# Altium schematic sheet fpga-bank1.SchDoc: FPGA - Bank 1
size Legal; CheckedBy: J. Brinton; CompanyName: Signal Laboratories, Inc.; DrawnBy: J. Brinton; Engineer: J. Brinton; Address1: 3479 Edison Way; Address2: Menlo Park CA 94025; Address3: +1 (877) 778-8435; Address4: siglabs.com; DocumentNumber: 28; Revision: 2b; SheetNumber: 29; SheetTotal: 58
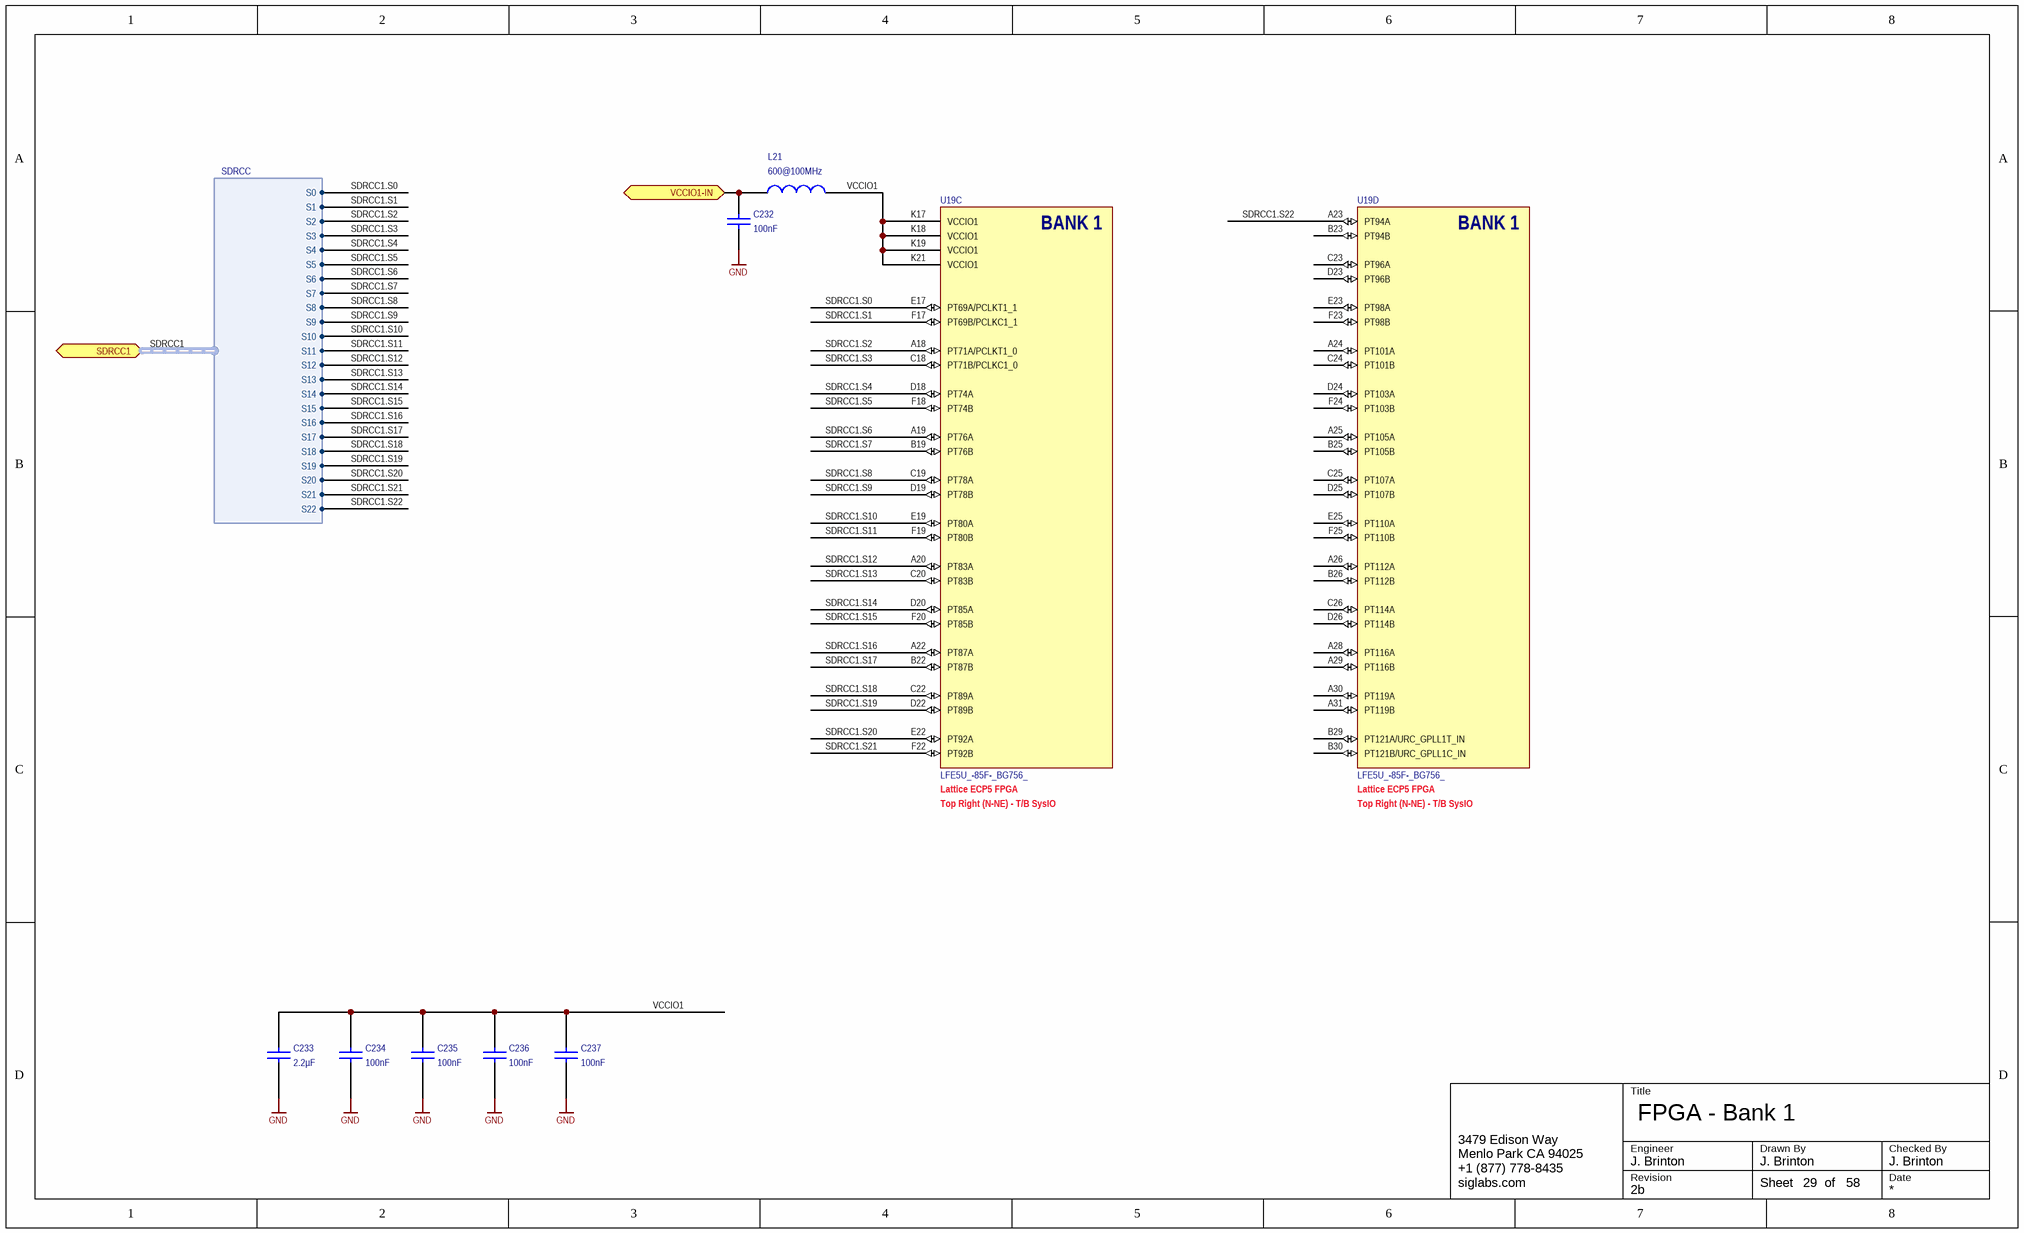
[diagram p0: fpga-bank1.SchDoc]

## Parts
C232  value 100nF  [CAPC1005X56N]  (hidden comment: GRM155R71C104KA88J)
C233  value 2.2µF  [CAPC1608X90N]  (hidden comment: GRM21BR71C225KA12L)
C234  value 100nF  [CAPC1005X56N]  (hidden comment: GRM155R71C104KA88J)
C235  value 100nF  [CAPC1005X56N]  (hidden comment: GRM155R71C104KA88J)
C236  value 100nF  [CAPC1005X56N]  (hidden comment: GRM155R71C104KA88J)
C237  value 100nF  [CAPC1005X56N]  (hidden comment: GRM155R71C104KA88J)
L21  value 600@100MHz  [0402]  (hidden comment: BLM15PX601SN1D)
U19  LFE5U_-85F-_BG756_  [caBGA756]  (parts C,D of 19)

## Ports
SDRCC1 (harness SDRCC), VCCIO1-IN

## Harnesses
SDRCC: S0, S1, S2, S3, S4, S5, S6, S7, S8, S9, S10, S11, S12, S13, S14, S15, S16, S17, S18, S19, S20, S21, S22

## Nets
GND: C232.1 C233.1 C234.1 C235.1 C236.1 C237.1
SDRCC1.S0: U19.E17(PT69A/PCLKT1_1) ; port SDRCC1.S0
SDRCC1.S1: U19.F17(PT69B/PCLKC1_1) ; port SDRCC1.S1
SDRCC1.S2: U19.A18(PT71A/PCLKT1_0) ; port SDRCC1.S2
SDRCC1.S3: U19.C18(PT71B/PCLKC1_0) ; port SDRCC1.S3
SDRCC1.S4: U19.D18(PT74A) ; port SDRCC1.S4
SDRCC1.S5: U19.F18(PT74B) ; port SDRCC1.S5
SDRCC1.S6: U19.A19(PT76A) ; port SDRCC1.S6
SDRCC1.S7: U19.B19(PT76B) ; port SDRCC1.S7
SDRCC1.S8: U19.C19(PT78A) ; port SDRCC1.S8
SDRCC1.S9: U19.D19(PT78B) ; port SDRCC1.S9
SDRCC1.S10: U19.E19(PT80A) ; port SDRCC1.S10
SDRCC1.S11: U19.F19(PT80B) ; port SDRCC1.S11
SDRCC1.S12: U19.A20(PT83A) ; port SDRCC1.S12
SDRCC1.S13: U19.C20(PT83B) ; port SDRCC1.S13
SDRCC1.S14: U19.D20(PT85A) ; port SDRCC1.S14
SDRCC1.S15: U19.F20(PT85B) ; port SDRCC1.S15
SDRCC1.S16: U19.A22(PT87A) ; port SDRCC1.S16
SDRCC1.S17: U19.B22(PT87B) ; port SDRCC1.S17
SDRCC1.S18: U19.C22(PT89A) ; port SDRCC1.S18
SDRCC1.S19: U19.D22(PT89B) ; port SDRCC1.S19
SDRCC1.S20: U19.E22(PT92A) ; port SDRCC1.S20
SDRCC1.S21: U19.F22(PT92B) ; port SDRCC1.S21
SDRCC1.S22: U19.A23(PT94A) ; port SDRCC1.S22
VCCIO1: C233.2 C234.2 C235.2 C236.2 C237.2 L21.1 U19.K17(VCCIO1) U19.K18(VCCIO1) U19.K19(VCCIO1) U19.K21(VCCIO1)
VCCIO1-IN: C232.2 L21.2 ; port VCCIO1-IN

Not connected (* = marked no-connect by the designer): U19 A24(PT101A) A25(PT105A) A26(PT112A) A28(PT116A) A29(PT116B) A30(PT119A) A31(PT119B) B23(PT94B) B25(PT105B) B26(PT112B) B29(PT121A/URC_GPLL1T_IN) B30(PT121B/URC_GPLL1C_IN) C23(PT96A) C24(PT101B) C25(PT107A) C26(PT114A) D23(PT96B) D24(PT103A) D25(PT107B) D26(PT114B) E23(PT98A) E25(PT110A) F23(PT98B) F24(PT103B) F25(PT110B)

## Buses and harness runs
harness SDRCC1 = port SDRCC1

## Notes on the sheet
- (near U19) Top Right (N-NE) - T/B SysIO
- (near U19) Lattice ECP5 FPGA
- Title
- Engineer
- Revision
- Drawn By
- Checked By
- Date
- Sheet
- of
- (in symbol LFE5U_-85F-_BG756_, part C) BANK 1
- (in symbol LFE5U_-85F-_BG756_, part D) BANK 1

## Library data of the parts
C232 C234-C237 = GRM155R71A104KA01J: Ceramic Capacitor 100nF ±10% 16V X7R 0402; Manufacturer: Murata; Tr: -55:125; Manufacturer P/N: GRM155R71C104KA88J; Tolerance: ±10%; Package: 0402; Voltage: 16V
C233 = GRM188R71A225KE15D: Ceramic Capacitor 2.2uF ±10% 10V X7R 0603; Manufacturer: Murata; Tr: -55:125; Manufacturer P/N: GRM188R71A225KE15D; Tolerance: ±10%; Package: 0603; Voltage: 10V
L21 = IND 0402: Ferrite Bead 600-Ohm @ 100MHz 900mA 0402; Manufacturer: Murata; Tolerance: ±25%; Tr: -55:125; Manufacturer P/N: BLM15PX601SN1D; Package: 0402
U19 = LFE5U_-85F-_BG756_: ECP5 FPGA, 85k LUT, 756-caBGA; Manufacturer: Lattice Semiconductor; Manufacturer P/N: LFE5U_-85F-_BG756_